# EAGLE design Chronos (EAGLE 9.6.2)
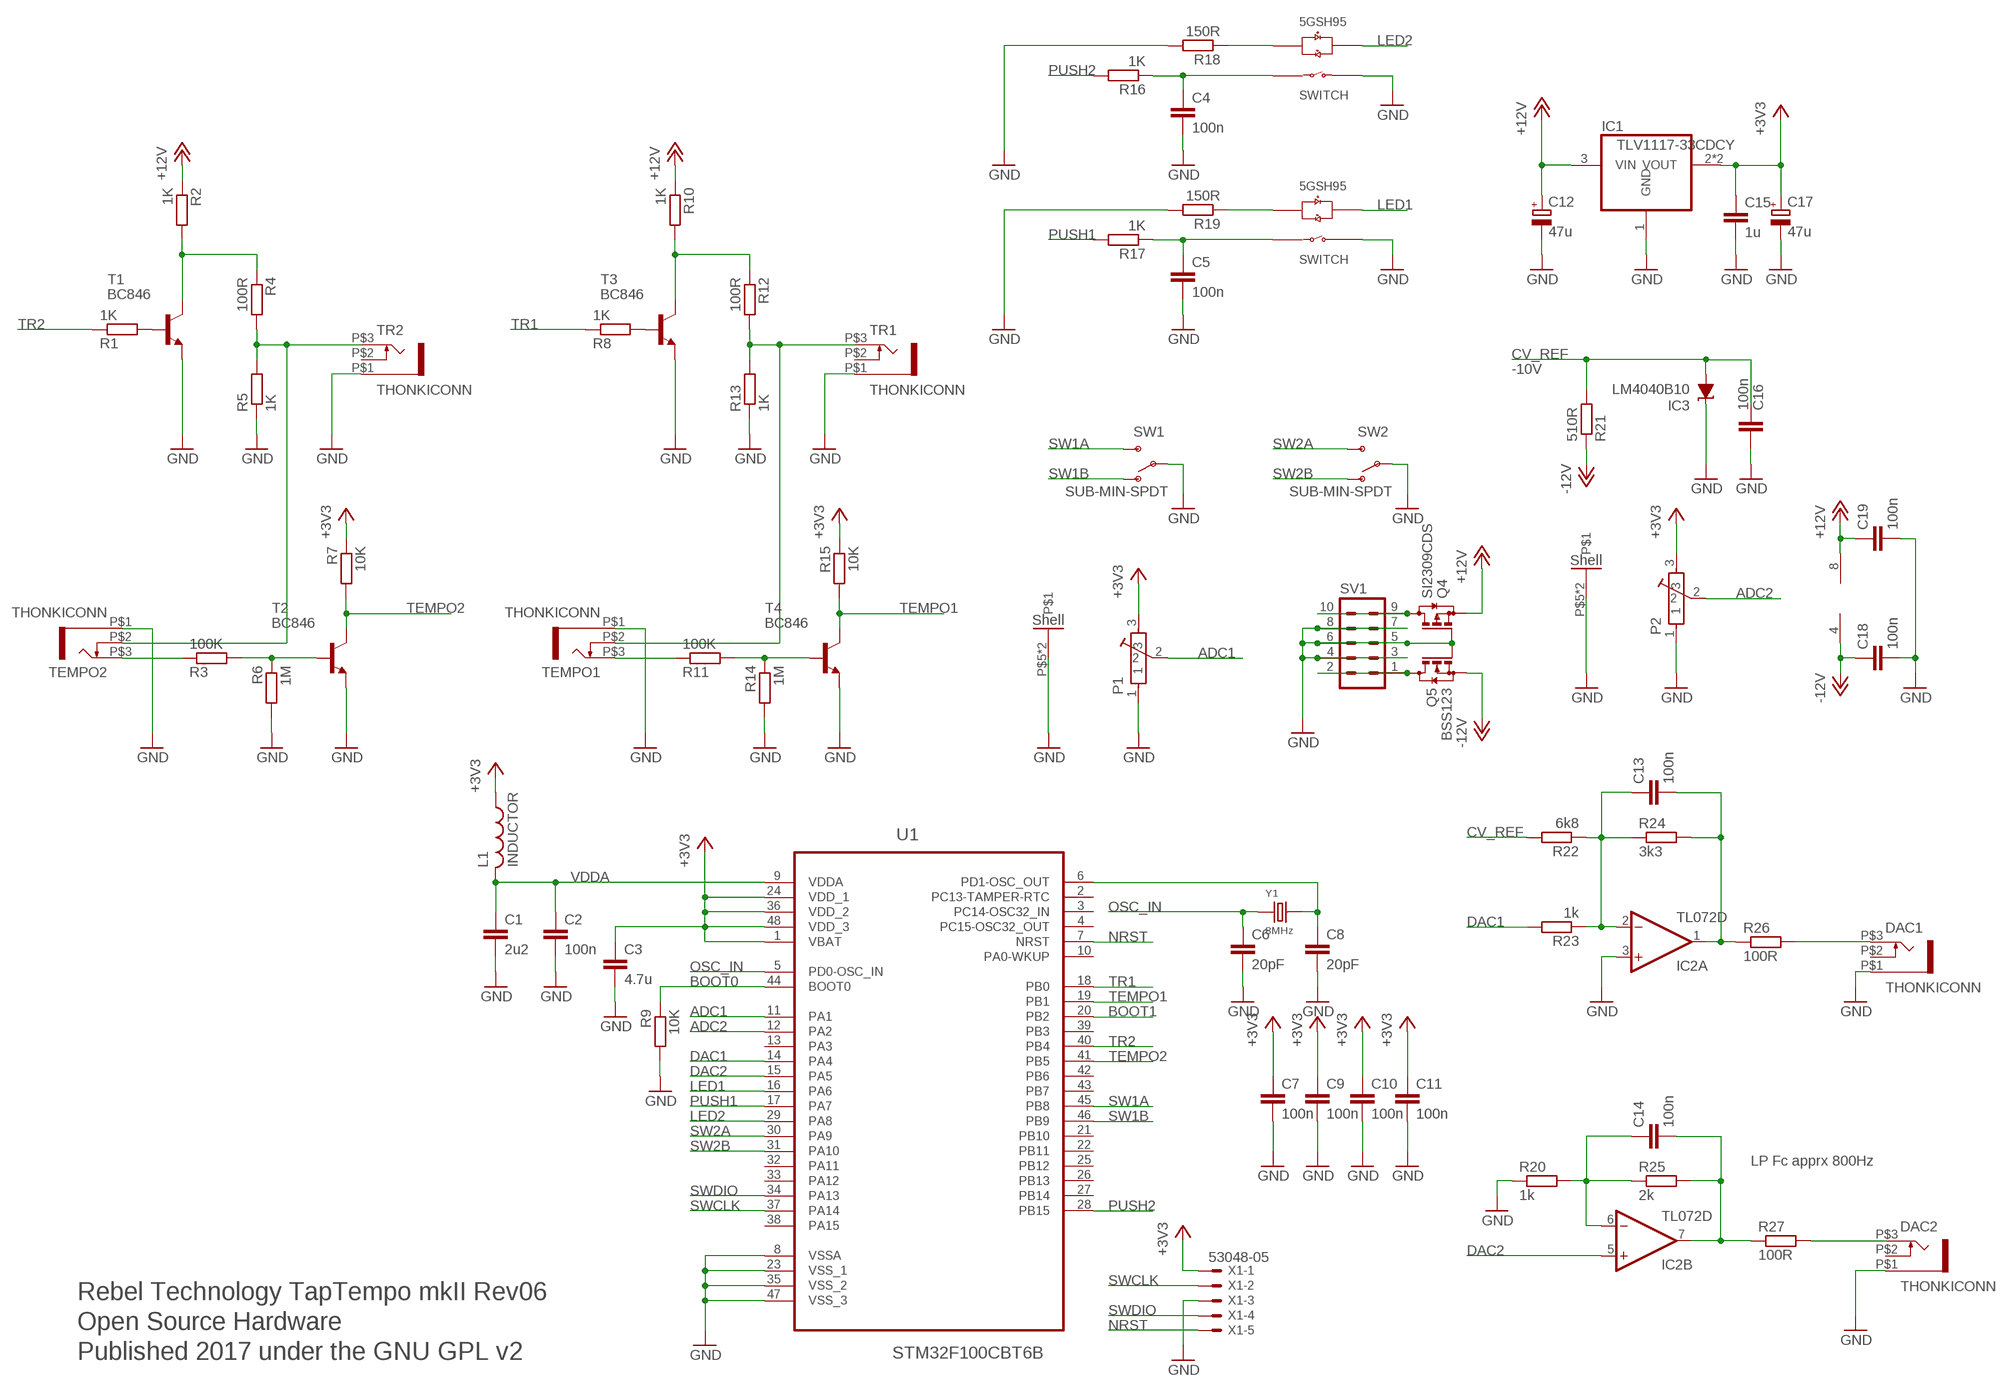
[diagram p0: schematic, sheet 1]

## Parts
C1  2u2  C-EUC0603  [C0603]
C2  100n  C-EUC0603  [C0603]
C3  4.7u  C-EUC0603  [C0603]
C4  100n  C-EUC0603  [C0603]
C5  100n  C-EUC0603  [C0603]
C6  20pF  C-EUC0603  [C0603]
C7  100n  C-EUC0603  [C0603]
C8  20pF  C-EUC0603  [C0603]
C9  100n  C-EUC0603  [C0603]
C10  100n  C-EUC0603  [C0603]
C11  100n  C-EUC0603  [C0603]
C12  47u  CPOL-EU153CLV-0505  [CPOL-5]
C13  100n  C-EUC0603  [C0603]
C14  100n  C-EUC0603  [C0603]
C15  1u  C-EUC0603  [C0603]
C16  100n  C-EUC0603  [C0603]
C17  47u  CPOL-EU153CLV-0505  [CPOL-5]
C18  100n  C-EUC0603  [C0603]
C19  100n  C-EUC0603  [C0603]
DAC1  THONKICONN  [THONKICONN]
DAC2  THONKICONN  [THONKICONN]
IC1  TLV1117-33CDCY  REG1117  [SOT223]
IC2  TL072D  [SO08]
IC3  LM4040B10  LM4041C12DBZ  [DBZ_R-PDSO-G3]
L1  INDUCTOR  [0603]
P1  POT-ALPS-RK09L1140  [POT-ALPS-RK09L1140]
P2  POT-ALPS-RK09L1140  [POT-ALPS-RK09L1140]
PUSH1  5GTH9  [5GTH9]
PUSH2  5GTH9  [5GTH9]
Q4  SI2309CDS  BSS84  [SOT23]
Q5  BSS123  [SOT23]
R1  1K  R-EU_0603  [0603]
R2  1K  R-EU_0603  [0603]
R3  100K  R-EU_0603  [0603]
R4  100R  R-EU_0603  [0603]
R5  1K  R-EU_0603  [0603]
R6  1M  R-EU_0603  [0603]
R7  10K  R-EU_0603  [0603]
R8  1K  R-EU_0603  [0603]
R9  10K  R-EU_0603  [0603]
R10  1K  R-EU_0603  [0603]
R11  100K  R-EU_0603  [0603]
R12  100R  R-EU_0603  [0603]
R13  1K  R-EU_0603  [0603]
R14  1M  R-EU_0603  [0603]
R15  10K  R-EU_0603  [0603]
R16  1K  R-EU_0603  [0603]
R17  1K  R-EU_0603  [0603]
R18  150R  R-EU_0603  [0603]
R19  150R  R-EU_0603  [0603]
R20  1k  R-EU_0603  [0603]
R21  510R  R-EU_0603  [0603]
R22  6k8  R-EU_0603  [0603]
R23  1k  R-EU_0603  [0603]
R24  3k3  R-EU_0603  [0603]
R25  2k  R-EU_0603  [0603]
R26  100R  R-EU_0603  [0603]
R27  100R  R-EU_0603  [0603]
SV1  MA05-2  [MA05-2]
SW1  SUB-MIN-SPDT  [SUB-MIN-SPDT]
SW2  SUB-MIN-SPDT  [SUB-MIN-SPDT]
T1  BC846  [SOT23]
T2  BC846  [SOT23]
T3  BC846  [SOT23]
T4  BC846  [SOT23]
TEMPO1  THONKICONN  [THONKICONN]
TEMPO2  THONKICONN  [THONKICONN]
TR1  THONKICONN  [THONKICONN]
TR2  THONKICONN  [THONKICONN]
U1  STM32F100CBT6B  [QFP50P900X900X160-48N]
X1  53048-05  [53048-05]
Y1  8MHz  SMD-CRYSTAL-8MHZ-20PF-20PPM(2P-5.0X3.2MM)  [X2-SMD-5.0X3.2X1.3MM]

## Nets
+3V3: C3.1 C7.1 C9.1 C10.1 C11.1 C15.1 C17.+ IC1.2(VOUT) IC1.4(VOUT) L1.1 P1.3 P2.3 R7.1 R15.1 U1.1(VBAT) U1.24(VDD_1) U1.36(VDD_2) U1.48(VDD_3) X1.1
+12V: C12.+ C19.1 IC1.3(VIN) IC2.8(P:V+) Q4.2(S) R2.1 R10.1
-12V: C18.1 IC2.4(P:V-) Q5.2(S) R21.1
ADC1: P1.2 U1.11(PA1)
ADC2: P2.2 U1.12(PA2)
BOOT0: R9.1 U1.44(BOOT0)
BOOT1: U1.20(PB2)
CV_REF: C16.1 IC3.2(A) R21.2 R22.2
DAC1: R23.2 U1.14(PA4)
DAC2: IC2.5(B:+IN) U1.15(PA5)
GND: C1.2 C2.2 C3.2 C4.2 C5.2 C6.2 C7.2 C8.2 C9.2 C10.2 C11.2 C12.- C15.2 C16.2 C17.- C18.2 C19.2 DAC1.P$1 DAC2.P$1 IC1.1(GND) IC2.3(A:+IN) IC3.1(C) P1.1 P1.P$5 P1.P$6 P2.1 P2.P$5 P2.P$6 PUSH1.1(SWITCH_B) PUSH2.1(SWITCH_B) Q4.1(G) Q5.1(G) R5.1 R6.2 R9.2 R13.1 R14.2 R18.2 R19.2 R20.1 SV1.3 SV1.4 SV1.5 SV1.6 SV1.7 SV1.8 SW1.2(P) SW2.2(P) T1.2(E) T2.2(E) T3.2(E) T4.2(E) TEMPO1.P$1 TEMPO2.P$1 TR1.P$1 TR2.P$1 U1.8(VSSA) U1.23(VSS_1) U1.35(VSS_2) U1.47(VSS_3) X1.3
LED1: PUSH1.+3(LED_R+) U1.16(PA6)
LED2: PUSH2.+3(LED_R+) U1.29(PA8)
N$1: C8.1 U1.6(PD1-OSC_OUT) Y1.2
N$2: PUSH1.-2(LED_G+) R19.1
N$3: C14.2 IC2.7(B:OUT) R25.2 R27.1
N$4: C14.1 IC2.6(B:-IN) R20.2 R25.1
N$5: R12.2 R13.2 TEMPO1.P$2 TR1.P$3
N$6: Q4.3(D) SV1.9 SV1.10
N$7: C13.2 IC2.1(A:OUT) R24.2 R26.1
N$9: PUSH2.-2(LED_G+) R18.1
N$10: R3.2 R6.1 T2.1(B)
N$11: R1.2 T1.1(B)
N$12: R2.2 R4.1 T1.3(C)
N$13: C13.1 IC2.2(A:-IN) R22.1 R23.1 R24.1
N$14: R3.1 TEMPO2.P$3
N$15: R4.2 R5.2 TEMPO2.P$2 TR2.P$3
N$16: Q5.3(D) SV1.1 SV1.2
N$17: C5.1 PUSH1.4(SWITCH_A) R17.1
N$18: C4.1 PUSH2.4(SWITCH_A) R16.1
N$23: R11.1 TEMPO1.P$3
N$27: R11.2 R14.1 T4.1(B)
N$31: DAC1.P$3 R26.2
N$32: DAC2.P$3 R27.2
N$34: R8.2 T3.1(B)
N$38: R10.2 R12.1 T3.3(C)
NRST: U1.7(NRST) X1.5
OSC_IN: C6.1 U1.5(PD0-OSC_IN) Y1.1
PUSH1: R17.2 U1.17(PA7)
PUSH2: R16.2 U1.28(PB15)
SW1A: SW1.3(S) U1.45(PB8)
SW1B: SW1.1(O) U1.46(PB9)
SW2A: SW2.3(S) U1.30(PA9)
SW2B: SW2.1(O) U1.31(PA10)
SWCLK: U1.37(PA14) X1.2
SWDIO: U1.34(PA13) X1.4
TEMPO1: R15.2 T4.3(C) U1.19(PB1)
TEMPO2: R7.2 T2.3(C) U1.41(PB5)
TR1: R8.1 U1.18(PB0)
TR2: R1.1 U1.40(PB4)
VDDA: C1.1 C2.1 L1.2 U1.9(VDDA)
Unconnected: DAC1.P$2 DAC2.P$2 TR1.P$2 TR2.P$2 U1.2(PC13-TAMPER-RTC) U1.3(PC14-OSC32_IN) U1.4(PC15-OSC32_OUT) U1.10(PA0-WKUP) U1.13(PA3) U1.21(PB10) U1.22(PB11) U1.25(PB12) U1.26(PB13) U1.27(PB14) U1.32(PA11) U1.33(PA12) U1.38(PA15) U1.39(PB3) U1.42(PB6) U1.43(PB7)

## Notes on the sheet
- -10V
- LP Fc apprx 800Hz
- Rebel Technology TapTempo mkII Rev06
- Open Source Hardware
- Published 2017 under the GNU GPL v2

## Library data of the parts
C1-C11 C13-C16 C18 C19 = Rebel:C-EU: CAPACITOR, European symbol
C12 C17 = Rebel:CPOL-EU: POLARIZED CAPACITOR, European symbol; FARNELL: 882-3014
DAC1 DAC2 TEMPO1 TEMPO2 TR1 TR2 = Rebel:THONKICONN
IC1 = burr-brown:REG1117: 800mA and 1A Low Dropout (LDO) Positive Regulator 1.8V, 2.5V, 2.85V, 3.3V, 5V, and Adj; FARNELL: 149-4942; MPN: REG1117; OC_FARNELL: 1097566; OC_NEWARK: 14P6981
IC2 = linear:TL072: OP AMP
IC3 = texas:LM4041: PRECISION MICROPOWER SHUNT VOLTAGE REFERENCE Source: http://focus.ti.com/lit/ds/slcs146e/slcs146e.pdf; MF: TEXAS INSTRUMENT CONNECTORS; MPN: LM4041C12QDBZT; OC_FARNELL: 1771733; OC_NEWARK: 43K3376
L1 = Rebel:INDUCTOR
P1 P2 = Rebel:POT-ALPS-RK09L
PUSH1 PUSH2 = SWITCH-5GTH9:5GTH9
Q4 = transistor-small-signal:BSS84: P-CHANNEL MOS FET; OC_FARNELL: 1779264
Q5 = transistor-small-signal:BSS123: N-CHANNEL MOS FET; OC_FARNELL: 1843725
R1-R27 = Rebel:R-EU_: RESISTOR, European symbol
SV1 = con-lstb:MA05-2: PIN HEADER; OC_FARNELL: unknown; OC_NEWARK: unknown
SW1 SW2 = Rebel:SUB-MIN-SPDT
T1-T4 = transistor:BC846: NPN TRANSISTOR
U1 = Rebel:STM32F100CBT6B: ARM-based 32-bit MCU; MPN: STM32F100CBT6B; OC_FARNELL: 1838512; OC_NEWARK: 86R1308; PACKAGE: LQFP-48; SUPPLIER: STMircroelectronics
X1 = con-molex:53?-05: CONNECTOR wire to board 1.25 mm (.049 inch) pitch header; MF: MOLEX; MPN: 53048-0510; OC_FARNELL: 9732926; OC_NEWARK: 57H4722
Y1 = Seeed-OPL-crystal-osctllator:SMD-CRYSTAL-8MHZ-20PF-20PPM(2P-5.0X3.2MM): 306010004; MPN: 5032/2P; VALUE: 5032/2p

## Board
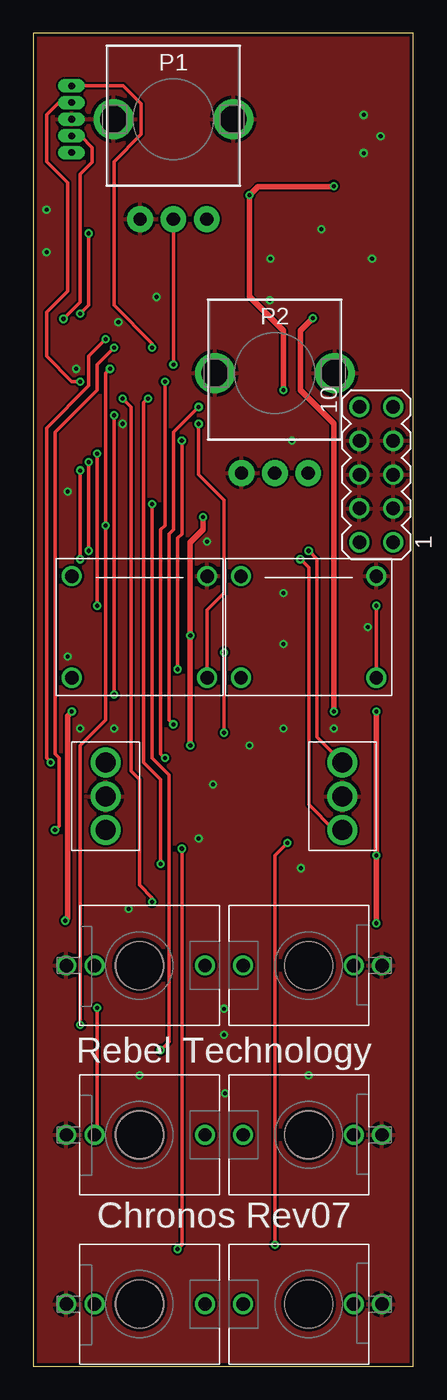
[diagram p1: board, top side]
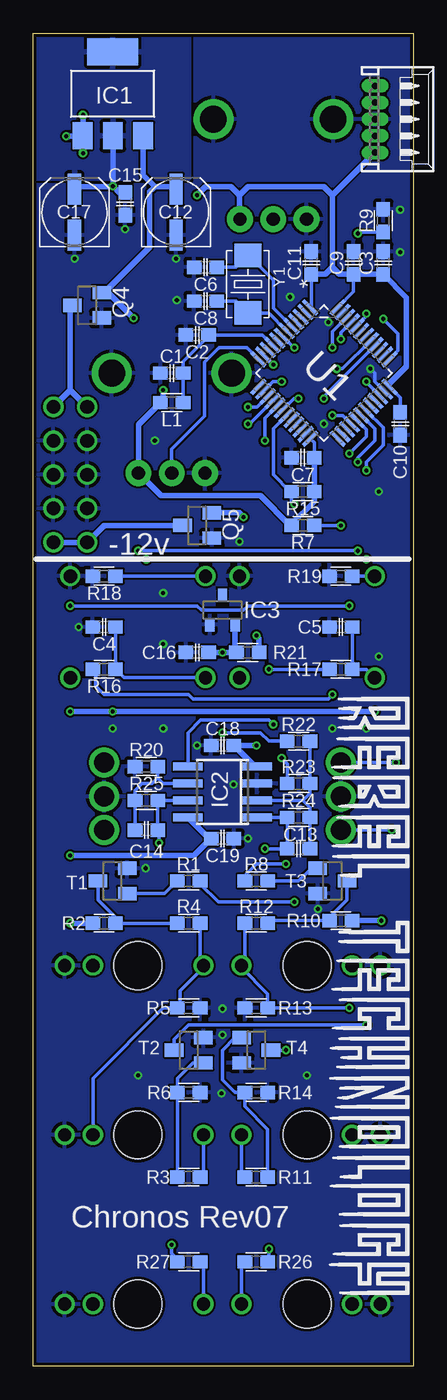
[diagram p2: board, bottom side, seen from below]

Size 28.53 x 100 mm. Coordinates in mm from the lower left corner, seen from the top.
Outline: 28.53,0 28.53,100 0,100 0,0 28.53,0
Copper layers (1*16): Top 0.035mm / dielectric 1.5mm / Bottom 0.035mm
Design rules "SeeedStudio_2layer_DRU_no_angle_20140221": minimum track width 6mil, minimum drill 12mil, track to track 6mil, track to pad 6mil, pad to pad 6mil, via to via 6mil, smd to smd 0mil, copper to edge 10mil, drill to drill 10mil, minimum pad ring 10mil, minimum via ring 6mil, stop-mask expansion 2mil, vias tented up to drill 100mil, thermal gap 10mil

### Footprints (pad centres in the part's own frame; a part is rotated, then mirrored left to right if it is on the bottom)
C0603 = smd 1.1 x 1: 1 -0.85,0; 2 0.85,0
CPOL-5 = smd 2.3 x 1: + 1.725,0; - -1.725,0
THONKICONN = drill 1: P$1 0,-5.5; P$2 0,-3.38; P$3 0,4.92 | hole 3.6: 0,0
SOT223 = smd 1.499 x 2.007: 1 -2.261,-3.15; 2 0.025,-3.15; 3 2.311,-3.15 | smd 3.81 x 2.007: 4 0,3.15
SO08 = smd 0.6 x 2.2: 1 -1.905,-2.6; 2 -0.635,-2.6; 3 0.635,-2.6; 4 1.905,-2.6; 5 1.905,2.6; 6 0.635,2.6; 7 -0.635,2.6; 8 -1.905,2.6
DBZ_R-PDSO-G3 = smd 0.7 x 1: 1 -0.95,-1.1; 2 0.95,-1.1; 3 0,1.1
0603 = smd 1.1 x 1: 1 -0.85,0; 2 0.85,0
POT-ALPS-RK09L1140 = drill 1 pad 1.93: 1 -2.5,-7.5; 2 0,-7.5; 3 2.5,-7.5 | drill 2: P$5 -4.5,0; P$6 4.5,0
5GTH9 = drill 1: 1 5.08,3.81; 4 -5.08,-3.81; +3 5.08,-3.81; -2 -5.08,3.81
SOT23 = smd 1 x 1.4: 1 -0.95,-1.1; 2 0.95,-1.1; 3 0,1.1
MA05-2 = drill 1.016: 1 -5.08,-1.27; 2 -5.08,1.27; 3 -2.54,-1.27; 4 -2.54,1.27; 5 0,-1.27; 6 0,1.27; 7 2.54,-1.27; 8 2.54,1.27; 9 5.08,-1.27; 10 5.08,1.27
SUB-MIN-SPDT = drill 1.5: 1 0,-2.54; 2 0,0; 3 0,2.54
QFP50P900X900X160-48N = smd 1.473 x 0.279: 1 -4.216,2.743; 2 -4.216,2.261; 3 -4.216,1.753; 4 -4.216,1.245; 5 -4.216,0.762; 6 -4.216,0.254; 7 -4.216,-0.254; 8 -4.216,-0.762; 9 -4.216,-1.245; 10 -4.216,-1.753; 11 -4.216,-2.261; 12 -4.216,-2.743; 25 4.216,-2.743; 26 4.216,-2.261; 27 4.216,-1.753; 28 4.216,-1.245; 29 4.216,-0.762; 30 4.216,-0.254; 31 4.216,0.254; 32 4.216,0.762; 33 4.216,1.245; 34 4.216,1.753; 35 4.216,2.261; 36 4.216,2.743 | smd 0.279 x 1.473: 13 -2.743,-4.216; 14 -2.261,-4.216; 15 -1.753,-4.216; 16 -1.245,-4.216; 17 -0.762,-4.216; 18 -0.254,-4.216; 19 0.254,-4.216; 20 0.762,-4.216; 21 1.245,-4.216; 22 1.753,-4.216; 23 2.261,-4.216; 24 2.743,-4.216; 37 2.743,4.216; 38 2.261,4.216; 39 1.753,4.216; 40 1.245,4.216; 41 0.762,4.216; 42 0.254,4.216; 43 -0.254,4.216; 44 -0.762,4.216; 45 -1.245,4.216; 46 -1.753,4.216; 47 -2.261,4.216; 48 -2.743,4.216
53048-05 = drill 0.5 pad 0.698 long: 1 2.5,-1.25; 2 1.25,-1.25; 3 0,-1.25; 4 -1.25,-1.25; 5 -2.5,-1.25
X2-SMD-5.0X3.2X1.3MM = smd 1.778 x 2.032: 1 -2.159,0; 2 2.159,0

### Placement (x,y rotation side)
C1  18.14,74.51 180 bottom
C2  16.23,77.37 180 bottom
C3  2.26,82.77 90 bottom
C4  23.22,55.46 180 bottom
C5  5.44,55.46 180 bottom
C6  15.6,82.45 180 bottom
C7  8.29,68.16 180 bottom
C8  15.6,79.91 180 bottom
C9  4.48,82.77 90 bottom
C10  0.99,70.7 270 bottom
C11  7.66,82.77 90 bottom
C12  17.82,86.58 90 bottom
C13  8.61,38.82 180 bottom
C14  20.04,40.22 0 bottom
C15  21.63,87.21 270 bottom
C16  16.23,53.56 180 bottom
C17  25.44,86.58 90 bottom
C18  14.33,46.57 180 bottom
C19  14.33,39.59 0 bottom
DAC1  7.98,4.66 270 top
DAC2  20.68,4.66 90 top
IC1  22.58,95.47 0 bottom
IC2  14.33,43.08 90 bottom
IC3  14.33,56.73 0 bottom
L1  18.14,72.29 0 bottom
P1  10.52,93.56 0 top
P2  18.14,74.51 0 top
PUSH1  7.98,55.46 0 top
PUSH2  20.68,55.46 0 top
Q4  24.49,79.59 90 bottom
Q5  16.23,63.08 90 bottom
R1  16.87,36.41 180 bottom
R2  23.22,33.24 0 bottom
R3  16.87,14.19 180 bottom
R4  16.87,33.24 0 bottom
R5  16.87,26.89 180 bottom
R6  16.87,20.54 0 bottom
R7  8.29,63.08 0 bottom
R8  11.79,36.41 0 bottom
R9  2.26,85.94 90 bottom
R10  5.44,33.43 180 bottom
R11  11.79,14.19 0 bottom
R12  11.79,33.24 180 bottom
R13  11.79,26.89 0 bottom
R14  11.79,20.54 0 bottom
R15  8.29,65.62 180 bottom
R16  23.22,52.29 180 bottom
R17  5.44,52.29 180 bottom
R18  23.22,59.27 180 bottom
R19  5.44,59.27 180 bottom
R20  20.04,44.98 0 bottom
R21  12.42,53.56 180 bottom
R22  8.61,46.89 180 bottom
R23  8.61,43.71 180 bottom
R24  8.61,41.17 180 bottom
R25  20.04,42.44 0 bottom
R26  11.79,7.84 180 bottom
R27  16.87,7.84 0 bottom
SV1  25.76,66.89 90 top
SW1  5.44,42.76 0 top
SW2  23.22,42.76 0 top
T1  22.58,36.41 90 bottom
T2  16.87,23.71 90 bottom
T3  6.07,36.41 270 bottom
T4  11.79,23.71 270 bottom
TEMPO1  7.98,17.36 270 top
TEMPO2  20.68,17.36 90 top
TR1  7.98,30.06 270 top
TR2  20.68,30.06 90 top
U1  6.71,74.51 315 bottom
X1  1.63,93.56 270 bottom
Y1  12.42,81.18 270 bottom

### Tracks (layer width: path | path; a pad name or v marks a point on that pad's centre or on a via)
+3V3  (via drill 0.3)
  Top 0.406: v18.77,73.24 18.77,77.69 16.23,80.23 v16.23,87.85 16.87,88.48 22.49,88.48 v22.56,88.54
  Bottom 0.254: C11.1 7.66,79.52 U1.1 | C9.1 4.48,80.61 U1.48 | C7.1 7.44,69.29 U1.24 | 9.14,63.18 R7.1 9.25,63.08 | C10.1 0.99,72.67 U1.36 1.78,73.72
  Bottom 0.406: IC1.2 v22.56,88.54 | v22.56,88.54 | v22.56,88.54 22.52,88.51 | 22.52,88.51 22.07,88.06 C15.1 | C17.+ 25.23,88.51 22.52,88.51 | X1.1 2.88,91.04 6.07,87.85 | 6.07,87.85 6.07,82.45 | C11.1 6.6,81.92 6.07,82.45 | 6.07,82.45 5.54,81.92 C9.1 C3.1 0.51,80.17 0.51,74.99 1.78,73.72 | C7.1 R15.1 7.44,64.88 9.14,63.18 | v18.77,73.24 18.77,72.5 L1.1 20.64,70.64 P2.3 18.93,65.3 11.47,65.3 9.25,63.08 | 6.07,87.85 6.71,88.48 12.42,88.48 13.06,87.85 | 13.06,87.85 13.06,86.1 P1.3 | v16.23,87.85 15.6,88.48 13.69,88.48 13.06,87.85
  pour Bottom: 16.87,100.55 16.87,89.12 29.57,89.12 29.57,100.55
+12V  (via drill 0.3)
  Top 0.406: v20.99,78.64 20.04,77.69 20.04,73.24 22.58,70.7 v22.58,49.11 | v2.9,49.11 2.58,48.79 2.58,33.62 v2.39,33.43 | v25.76,49.11 v25.76,38.32 v25.76,33.24
  Bottom 0.406: IC1.3 20.27,89.38 19.51,88.62 19.51,88.48 | v2.9,49.11 v22.58,49.11 v25.76,49.11 | v25.76,33.24 R2.1 | R10.1 v2.39,33.43 | IC2.8 15.34,39.59 C19.1 16.45,38.32 v25.76,38.32 | 19.51,88.48 19.51,88.38 19.79,88.1 19.79,83.95 23.2,80.54 Q4.2 22.9,80.54 v20.99,78.64 | C12.+ 18,88.48 19.51,88.48
-12V  (via drill 0.3)
  Top 0.406: v11.79,46.57 v11.79,54.83 11.79,61.81 12.74,62.76 v12.74,63.72
  Bottom 0.406: R21.1 11.57,54.61 v11.79,54.83 | v11.79,46.57 C18.1 11.89,44.98 IC2.4 | Q5.2 13.05,64.03 v12.74,63.72
ADC1  (via drill 0.3)
  Top 0.254: P1.2 v10.52,75.15
  Bottom 0.254: v10.52,75.15 10.54,75.15 U1.11
ADC2
  Bottom 0.254: P2.2 18.14,68.8 15.66,71.27 15.66,75.34 14.58,76.42 12.49,76.42 U1.12
BOOT0  (via drill 0.3)
  Top 0.254: v4.17,84.99 4.17,79.59 v3.53,78.96
  Bottom 0.254: R9.1 4.06,85.09 v4.17,84.99 | v3.53,78.96 3.53,78.76 U1.44
CV_REF  (via drill 0.3)
  Top 0.254: v14.33,47.52 v14.33,53.56
  Bottom 0.254: 13.38,53.66 R21.2 | R22.2 10.83,46.89 11.47,47.52 v14.33,47.52
  Bottom 0.406: R21.2 v14.33,53.56 C16.1 | IC3.2 13.38,53.66
DAC1  (via drill 0.3)
  Top 0.254: v9.88,45.62 9.56,45.94 9.56,62.76 9.88,63.08 v9.88,73.88
  Bottom 0.254: R23.2 9.46,45.2 v9.88,45.62 | v9.88,73.88 10.54,73.88 U1.14
DAC2  (via drill 0.3)
  Top 0.254: v10.52,48.16 10.2,48.48 10.2,62.45 10.52,62.76 10.52,70.07 v12.42,71.97
  Bottom 0.254: v12.42,71.97 11.72,71.97 U1.15 | v10.52,48.16 10.83,48.48 15.97,48.48 16.93,47.52 IC2.5
GND  (via drill 0.3)
  Bottom 0.254: U1.35 2.15,73.13 2.9,73.88 2.9,74.51 v3.21,74.83
  Bottom 0.406: IC1.1 24.8,92.32 | 24.8,92.32 24.8,92.29 | 24.8,92.29 v24.8,91.02 | v26.07,92.29 24.8,92.29 | 24.8,92.32 v24.8,93.88
  other vias: 17.82,83.08 25.44,83.08 19.41,69.43 18.77,47.84 22.58,47.84 18.77,54.19 18.77,58 20.1,37.36 20.68,21.81 7.98,21.81 6.39,78.32 9.25,80.23 6.71,70.7 2.58,53.24 3.53,47.84 6.07,47.84 2.58,65.62 16.23,46.57 12.42,39.59 7.15,34.32 14.33,26.82 14.33,24.85 14.39,20.47 13.5,43.65 25.12,55.46 13.06,61.87 21.63,85.31 0.99,86.77 0.99,83.59 17.75,79.97
  pour Bottom (rank 2): 29.57,-0.42 -1.55,-0.42 -1.55,100.55 29.57,100.55
  pour Top: 30.2,-0.42 -0.91,-0.42 -0.91,100.55 30.2,100.55
LED1  (via drill 0.3)
  Top 0.254: PUSH1.+3 13.06,56.73 14.33,58 14.33,64.99 12.42,66.89 v12.42,70.7
  Bottom 0.254: v12.42,70.7 12.28,70.7 U1.16
LED2  (via drill 0.3)
  Top 0.254: PUSH2.+3 v25.76,57.05 | v4.8,57.05 v4.8,68.48
  Bottom 0.254: v25.76,57.05 16.23,57.05 15.91,56.73 12.74,56.73 12.42,57.05 v4.8,57.05 | v4.8,68.48 3.53,69.75 3.53,70.26 U1.29
N$1
  Bottom 0.254: U1.6 10.85,79.02 Y1.2 13.31,79.91 C8.1
N$2
  Bottom 0.254: PUSH1.-2 R19.1
N$3  (via drill 0.3)
  Top 0.254: v18.14,9.11 18.14,38.32 v19.09,39.27
  Bottom 0.254: IC2.7 R25.2 C14.2 19.09,40.12 v19.09,39.27 | R27.1 17.72,8.05 18.14,8.47 v18.14,9.11
N$4
  Bottom 0.254: IC2.6 18.77,43.71 19.19,44.13 | C14.1 R25.1 20.89,43.18 20.36,43.71 19.61,43.71 19.19,44.13 | R20.2 19.19,44.13
N$5  (via drill 0.3)
  Top 0.254: v4.8,26.89 4.8,17.57 TEMPO1.P$2
  Bottom 0.254: R12.2 12.64,30.32 TR1.P$3 12.9,29.9 10.94,27.94 R13.2 v4.8,26.89
N$6
  Bottom 0.406: 25.76,73.24 SV1.9 | SV1.10 25.76,73.24 | 25.76,73.24 25.76,79.42 Q4.3
N$7  (via drill 0.3)
  Top 0.254: v10.83,8.79 11.15,9.11 v11.15,38.82
  Bottom 0.254: IC2.1 R24.2 C13.2 v11.15,38.82 | R26.1 10.94,8.05 10.83,8.15 v10.83,8.79
N$9
  Bottom 0.254: PUSH2.-2 R18.1
N$10
  Bottom 0.254: R3.2 R6.1 17.72,21.59 16.55,22.76 T2.1
N$11
  Bottom 0.254: T1.1 18.67,35.46 R1.2
N$12
  Bottom 0.254: R4.1 R2.2 22.37,33.66 23.68,34.97 T1.3
N$13
  Bottom 0.254: IC2.2 8.29,42.44 | 8.29,42.44 7.76,41.91 R24.1 C13.1 | 8.29,42.44 7.76,42.98 R23.1 R22.1
N$14
  Bottom 0.254: TEMPO2.P$3 15.76,14.45 R3.1
N$15
  Bottom 0.254: R4.2 16.02,30.32 TR2.P$3 15.76,29.9 17.5,28.16 17.5,27.1 R5.2 18.77,26.89 24.06,21.6 TEMPO2.P$2
N$16
  Bottom 0.406: SV1.1 SV1.2 23.22,63.08 Q5.3
N$17
  Bottom 0.254: C5.1 R17.1 3.53,52.29 PUSH1.4
N$18
  Bottom 0.254: C4.1 R16.1 21.73,51.65 PUSH2.4
N$23
  Bottom 0.254: TEMPO1.P$3 12.9,14.45 R11.1
N$27
  Bottom 0.254: R11.2 10.94,17.78 12.64,19.48 R14.1 13.37,20.54 14.33,21.49 14.33,23.71 13.38,24.66 T4.1
N$31
  Bottom 0.254: DAC1.P$3 12.9,7.58 R26.2
N$32
  Bottom 0.254: DAC2.P$3 15.76,7.58 R27.2
N$34
  Bottom 0.254: T3.1 7.66,37.36 8.61,36.41 R8.2
N$38
  Bottom 0.254: R12.1 10.75,33.43 R10.2 6.29,33.66 4.97,34.97 T3.3
NRST  (via drill 0.3)
  Top 0.254: X1.5 6.75,96.06 8.1,94.7 8.1,92.42 6.07,90.39 6.07,79.59 8.93,76.73 v8.93,76.42
  Bottom 0.254: v8.93,76.42 8.97,76.42 U1.7
OSC_IN
  Bottom 0.254: U1.5 10.52,79.4 10.52,81.5 12.36,83.34 Y1.1 13.31,82.45 C6.1
PUSH1  (via drill 0.3)
  Top 0.254: v10.83,52.29 10.83,62.13 11.15,62.45 v11.15,69.43
  Bottom 0.254: R17.2 v10.83,52.29 | v11.15,69.43 11.15,71.14 U1.17
PUSH2  (via drill 0.3)
  Top 0.254: v6.07,71.34 v6.07,50.38
  Bottom 0.254: v6.07,50.38 6.39,50.06 16.55,50.06 16.87,50.38 23.22,50.38 23.85,51.02 23.85,52.07 R16.2 | v6.07,71.34 5.29,71.34 U1.28
SW1A  (via drill 0.3)
  Top 0.254: v1.31,45.3 0.99,45.62 0.99,70.38 4.17,73.56 4.17,75.78 v5.44,77.05
  Bottom 0.254: SW1.3 v1.31,45.3 | v5.44,77.05 5.44,77.54 U1.45
SW1B  (via drill 0.3)
  Top 0.254: v1.63,40.22 1.94,40.54 1.94,45.62 1.63,45.94 1.63,70.07 4.8,73.24 4.8,75.15 v6.07,76.42
  Bottom 0.254: SW1.1 v1.63,40.22 | v6.07,76.42 6.07,77.62 U1.46
SW2A  (via drill 0.3)
  Top 0.254: SW2.3 21.31,47.21 21.31,60.54 v20.68,61.18 | v4.17,61.18 v4.17,67.84
  Bottom 0.254: v20.68,61.18 v4.17,61.18 | v4.17,67.84 4.17,68.16 2.9,69.43 2.9,70.34 U1.30
SW2B  (via drill 0.3)
  Top 0.254: SW2.1 22.58,40.22 20.68,42.13 20.68,59.91 v20.04,60.54 | v3.53,60.54 v3.53,67.21
  Bottom 0.254: v20.04,60.54 v3.53,60.54 | v3.53,67.21 3.53,67.84 2.26,69.11 2.26,70.42 U1.31
SWCLK  (via drill 0.3)
  Top 0.254: X1.2 3.55,92.31 4.42,91.41 4.42,90.32 3.53,89.43 3.53,79.84 v2.26,78.58
  Bottom 0.254: v2.26,78.58 1.15,77.46 1.15,76.19 U1.37
SWDIO  (via drill 0.3)
  Top 0.254: X1.4 1.92,94.81 0.99,93.88 0.99,90.39 2.58,88.8 2.58,80.67 0.99,79.08 0.99,75.78 2.9,73.88 v3.53,73.88
  Bottom 0.254: U1.34 3.53,73.81 v3.53,73.88
TEMPO1  (via drill 0.3)
  Top 0.254: v8.93,64.67 8.93,45.62 10.2,44.35 10.2,24.35 v9.56,23.71
  Bottom 0.254: T4.3 v9.56,23.71 | U1.19 10.52,70.34 10.52,66.89 9.25,65.62 R15.2 9.14,64.77 v8.93,64.67
TEMPO2  (via drill 0.3)
  Top 0.254: v5.75,74.83 5.44,74.51 v5.44,63.08 5.44,48.48 3.53,46.57 v3.53,25.62
  Bottom 0.254: v5.75,74.83 5.31,74.83 U1.41 | v3.53,25.62 16.87,25.62 17.97,24.52 T2.3 | R7.2 v5.44,63.08
TR1  (via drill 0.3)
  Top 0.254: v9.56,37.68 9.56,44.03 8.29,45.3 8.29,72.29 v8.61,72.61
  Bottom 0.254: v8.61,72.61 8.97,72.61 U1.18 | R8.1 12.64,36.83 11.79,37.68 v9.56,37.68
TR2  (via drill 0.3)
  Top 0.254: v8.93,34.82 8.93,35.14 7.98,36.09 7.98,44.03 7.34,44.67 7.34,71.97 v6.71,72.61
  Bottom 0.254: R1.1 16.02,36.2 14.64,34.82 v8.93,34.82 | v6.71,72.61 6.71,72.75 U1.40
VDDA
  Bottom 0.254: U1.9 11.32,77.37 C2.1 15.38,77.27 17.29,75.36 C1.1 L1.2

### Text on the board
tPlace: Rebel Technology | Chronos Rev07
bPlace: -12v | Chronos Rev07